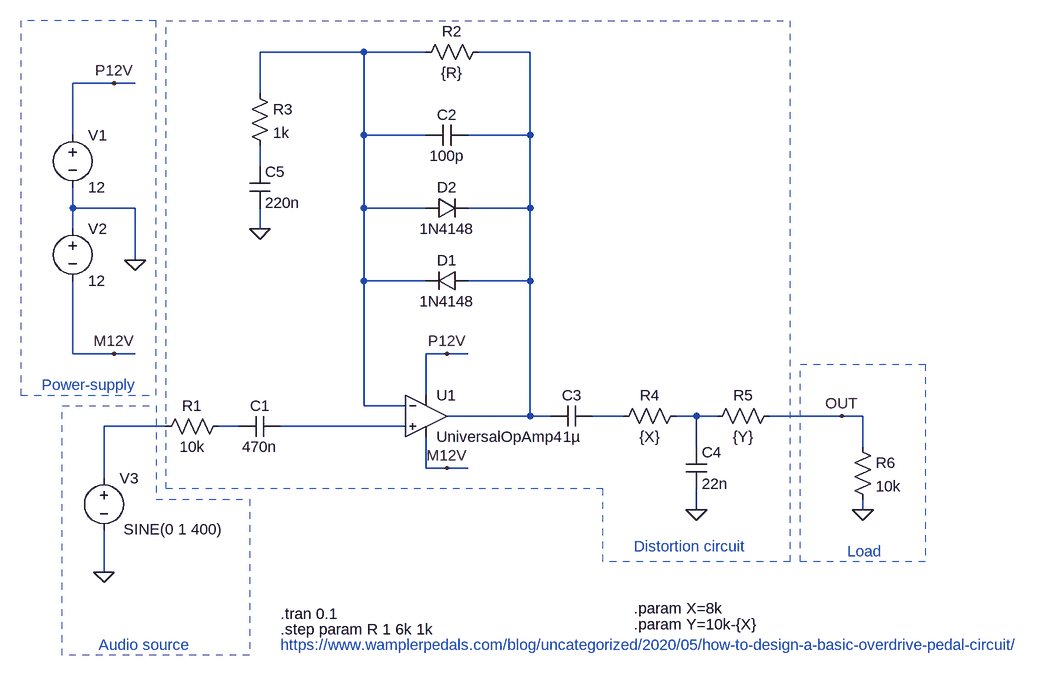
[diagram p0: schematic distortion_pedal_fine_tune.asc]
distortion_pedal_fine_tune.asc, the LTspice schematic file:
Version 4
SHEET 1 1616 880
WIRE 368 -544 208 -544
WIRE 464 -544 368 -544
WIRE 624 -544 544 -544
WIRE -16 -496 -80 -496
WIRE 16 -496 -16 -496
WIRE 208 -480 208 -544
WIRE -80 -416 -80 -496
WIRE 368 -416 368 -544
WIRE 464 -416 368 -416
WIRE 624 -416 624 -544
WIRE 624 -416 528 -416
WIRE 208 -368 208 -400
WIRE -80 -304 -80 -336
WIRE 16 -304 -80 -304
WIRE 368 -304 368 -416
WIRE 464 -304 368 -304
WIRE 624 -304 624 -416
WIRE 624 -304 528 -304
WIRE -80 -272 -80 -304
WIRE 208 -272 208 -304
WIRE 16 -224 16 -304
WIRE 368 -192 368 -304
WIRE 464 -192 368 -192
WIRE 624 -192 624 -304
WIRE 624 -192 528 -192
WIRE -80 -80 -80 -192
WIRE -16 -80 -80 -80
WIRE 16 -80 -16 -80
WIRE 496 -80 464 -80
WIRE 528 -80 496 -80
WIRE 464 -16 464 -80
WIRE 368 0 368 -192
WIRE 432 0 368 0
WIRE 624 16 624 -192
WIRE 624 16 496 16
WIRE 656 16 624 16
WIRE 768 16 720 16
WIRE 880 16 848 16
WIRE 912 16 880 16
WIRE 1104 16 992 16
WIRE 1136 16 1104 16
WIRE 64 32 -32 32
WIRE 176 32 144 32
WIRE 432 32 240 32
WIRE 880 64 880 16
WIRE 1136 64 1136 16
WIRE 464 96 464 48
WIRE 496 96 464 96
WIRE 528 96 496 96
WIRE -32 112 -32 32
WIRE 880 160 880 128
WIRE 1136 160 1136 144
WIRE -32 256 -32 192
FLAG 16 -224 0
FLAG -16 -496 P12V
FLAG -16 -80 M12V
FLAG -32 256 0
FLAG 496 -80 P12V
FLAG 496 96 M12V
FLAG 208 -272 0
FLAG 1136 160 0
FLAG 880 160 0
FLAG 1104 16 OUT
SYMBOL OpAmps\\UniversalOpAmp4 464 16 R0
SYMATTR InstName U1
SYMBOL voltage -80 -432 R0
WINDOW 123 0 0 Left 0
WINDOW 39 0 0 Left 0
SYMATTR InstName V1
SYMATTR Value 12
SYMBOL voltage -80 -288 R0
WINDOW 123 0 0 Left 0
WINDOW 39 0 0 Left 0
SYMATTR InstName V2
SYMATTR Value 12
SYMBOL cap 240 16 R90
WINDOW 0 0 32 VBottom 2
WINDOW 3 32 32 VTop 2
SYMATTR InstName C1
SYMATTR Value 470n
SYMBOL res 160 16 R90
WINDOW 0 0 56 VBottom 2
WINDOW 3 32 56 VTop 2
SYMATTR InstName R1
SYMATTR Value 10k
SYMBOL voltage -32 96 R0
WINDOW 3 30 94 Left 2
WINDOW 123 0 0 Left 0
WINDOW 39 0 0 Left 0
SYMATTR Value SINE(0 1 400)
SYMATTR InstName V3
SYMBOL diode 528 -208 R90
WINDOW 0 0 32 VBottom 2
WINDOW 3 32 32 VTop 2
SYMATTR InstName D1
SYMATTR Value 1N4148
SYMBOL diode 464 -288 R270
WINDOW 0 32 32 VTop 2
WINDOW 3 0 32 VBottom 2
SYMATTR InstName D2
SYMATTR Value 1N4148
SYMBOL cap 528 -432 R90
WINDOW 0 0 32 VBottom 2
WINDOW 3 32 32 VTop 2
SYMATTR InstName C2
SYMATTR Value 100p
SYMBOL res 560 -560 R90
WINDOW 0 0 56 VBottom 2
WINDOW 3 32 56 VTop 2
SYMATTR InstName R2
SYMATTR Value {R}
SYMBOL res 192 -496 R0
SYMATTR InstName R3
SYMATTR Value 1k
SYMBOL cap 720 0 R90
WINDOW 0 0 32 VBottom 2
WINDOW 3 32 32 VTop 2
SYMATTR InstName C3
SYMATTR Value 1µ
SYMBOL res 864 0 R90
WINDOW 0 0 56 VBottom 2
WINDOW 3 32 56 VTop 2
SYMATTR InstName R4
SYMATTR Value {X}
SYMBOL res 1008 0 R90
WINDOW 0 0 56 VBottom 2
WINDOW 3 32 56 VTop 2
SYMATTR InstName R5
SYMATTR Value {Y}
SYMBOL res 1120 48 R0
SYMATTR InstName R6
SYMATTR Value 10k
SYMBOL cap 864 64 R0
SYMATTR InstName C4
SYMATTR Value 22n
SYMBOL cap 192 -368 R0
SYMATTR InstName C5
SYMATTR Value 220n
TEXT 240 320 Left 2 !.tran 0.1
TEXT 240 344 Left 2 !.step param R 1 6k 1k
TEXT 240 368 Left 2 ;https://www.wamplerpedals.com/blog/uncategorized/2020/05/how-to-design-a-basic-overdrive-pedal-circuit/
TEXT 784 312 Left 2 !.param X=8k
TEXT 784 336 Left 2 !.param Y=10k-{X}
TEXT -40 368 Left 2 ;Audio source
TEXT 784 216 Left 2 ;Distortion circuit
TEXT 1112 224 Left 2 ;Load
TEXT -128 -32 Left 2 ;Power-supply
LINE Normal -96 384 -96 0 2
LINE Normal 192 384 -96 384 2
LINE Normal 192 144 192 384 2
LINE Normal 48 144 192 144 2
LINE Normal 48 0 48 144 2
LINE Normal -96 0 48 0 2
LINE Normal 64 128 64 -592 2
LINE Normal 736 128 64 128 2
LINE Normal 736 240 736 128 2
LINE Normal 1024 240 736 240 2
LINE Normal 1024 -592 1024 240 2
LINE Normal 64 -592 1024 -592 2
LINE Normal 1040 240 1040 -64 2
LINE Normal 1232 240 1040 240 2
LINE Normal 1232 -64 1232 240 2
LINE Normal 1040 -64 1232 -64 2
LINE Normal 48 -16 48 -592 2
LINE Normal -160 -16 48 -16 2
LINE Normal -160 -592 -160 -16 2
LINE Normal 48 -592 -160 -592 2

The netlist it stands for:
* distortion_pedal_fine_tune.asc
* U1: UniversalOpAmp4 (symbol OpAmps\UniversalOpAmp4 not available, pins judged from their places): In+=N008 In-=N001 V+=P12V V-=M12V OUT=N002
V1 P12V 0 12
V2 0 M12V 12
C1 N008 N007 470n
R1 N007 N006 10k
V3 N006 0 SINE(0 1 400)
D1 N002 N001 1N4148
D2 N001 N002 1N4148
C2 N002 N001 100p
R2 N002 N001 {R}
R3 N001 N003 1k
C3 N004 N002 1µ
R4 N005 N004 {X}
R5 OUT N005 {Y}
R6 OUT 0 10k
C4 N005 0 22n
C5 N003 0 220n
.model D D
.lib standard.dio
.tran 0.1
.step param R 1 6k 1k
* https://www.wamplerpedals.com/blog/uncategorized/2020/05/how-to-design-a-basic-overdrive-pedal-circuit/
.param X=8k
.param Y=10k-{X}
* Audio source
* Distortion circuit
* Load
* Power-supply
.backanno
.end